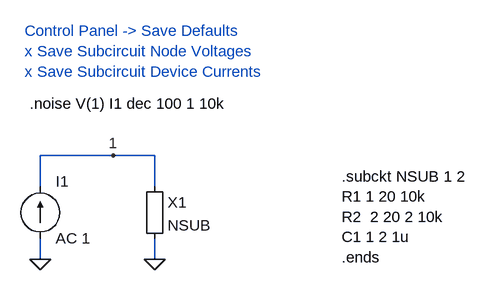
[diagram p0: schematic subcircuit_noise.asc]
subcircuit_noise.asc, the LTspice schematic file:
Version 4
SHEET 1 880 680
WIRE 160 64 48 64
WIRE 224 64 160 64
WIRE 48 112 48 64
WIRE 224 112 224 64
WIRE 48 224 48 192
WIRE 224 224 224 192
FLAG 48 224 0
FLAG 160 64 1
FLAG 224 224 0
SYMBOL current 48 192 M180
WINDOW 0 24 88 Left 0
WINDOW 3 24 0 Left 0
SYMATTR InstName I1
SYMATTR Value AC 1
SYMBOL Misc\\EuropeanResistor 208 96 R0
SYMATTR InstName X1
SYMATTR Value NSUB
SYMATTR Prefix X
TEXT 512 96 Left 0 !.subckt NSUB 1 2\nR1 1 20 10k\nR2  2 20 2 10k\nC1 1 2 1u\n.ends
TEXT 32 -16 Left 0 !.noise V(1) I1 dec 100 1 10k
TEXT 24 -128 Left 0 ;Control Panel -> Save Defaults\nx Save Subcircuit Node Voltages\nx Save Subcircuit Device Currents

The netlist it stands for:
* subcircuit_noise.asc
I1 0 1 AC 1
XX1 1 0 NSUB  ; pins A B
.subckt NSUB 1 2
R1 1 20 10k
R2  2 20 2 10k
C1 1 2 1u
.ends
.noise V(1) I1 dec 100 1 10k
* Control Panel -> Save Defaults
* x Save Subcircuit Node Voltages
* x Save Subcircuit Device Currents
.backanno
.end